# Altium project PCB_Project.PrjPcb
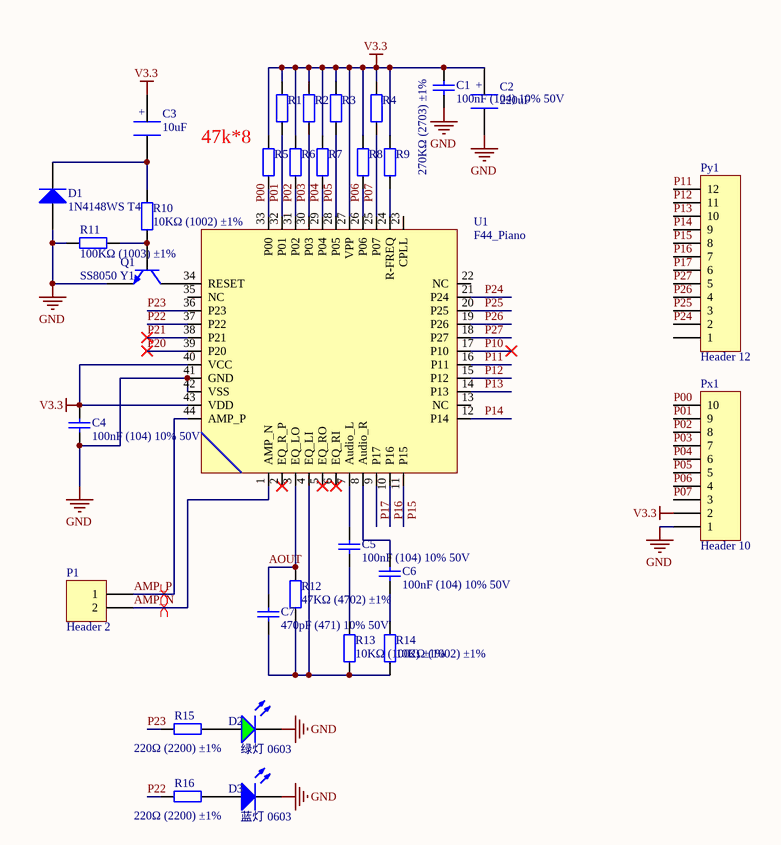
[diagram p0: F44.SchDoc]
4 sheets, 94 parts. Net scope: global (net labels, ports and power ports of the same name join across sheets).
Board file: f44.PcbDoc
Sheets:
  F44.SchDoc
  voice.SchDoc
  fft.SchDoc
  power.SchDoc

## Sheet F44.SchDoc
size A4

### Parts
C1  100nF (104) 10% 50V  [0603_C]
C2  220uF  [8X12_CAP]
C3  10uF  [HDR1X2]
C4  100nF (104) 10% 50V  [0603_C]
C5  100nF (104) 10% 50V  [0603_C]
C6  100nF (104) 10% 50V  [0603_C]
C7  470pF (471) 10% 50V  [0603_C]
D1  1N4148WS T4  [SOD-323]
D2  绿灯 0603  [0603_LED_S1]
D3  蓝灯 0603  [0603_LED_S1]
P1  Header 2  [XH2.54-WS-2P]
Px1  Header 10  [FPC1.0-2H-WS-10P]
Py1  Header 12  [FPC1.0-2H-WS-12P]
Q1  SS8050 Y1  [SOT-23(SOT-23-3)]
R1  47KΩ (4702) ±1%  [0603_R]  (value not drawn)
R2  47KΩ (4702) ±1%  [0603_R]  (value not drawn)
R3  47KΩ (4702) ±1%  [0603_R]  (value not drawn)
R4  47KΩ (4702) ±1%  [0603_R]  (value not drawn)
R5  47KΩ (4702) ±1%  [0603_R]  (value not drawn)
R6  47KΩ (4702) ±1%  [0603_R]  (value not drawn)
R7  47KΩ (4702) ±1%  [0603_R]  (value not drawn)
R8  47KΩ (4702) ±1%  [0603_R]  (value not drawn)
R9  270KΩ (2703) ±1%  [0603_R]
R10  10KΩ (1002) ±1%  [0603_R]
R11  100KΩ (1003) ±1%  [0603_R]
R12  47KΩ (4702) ±1%  [0603_R]
R13  10KΩ (1002) ±1%  [0603_R]
R14  10KΩ (1002) ±1%  [0603_R]
R15  220Ω (2200) ±1%  [0603_R]
R16  220Ω (2200) ±1%  [0603_R]
U1  F44_Piano  [LQFP-44_10x10x08P]

### Nets
GND: C1.1 C2.2 C4.2 D1.1(A) D2.K D3.K Px1.1 Q1.2(E) R11.1 U1.41(GND) U1.42(VSS)
V3.3: C1.2 C2.1 C3.1 C4.1 Px1.2 R1.2 R2.2 R3.2 R4.2 R5.2 R6.2 R7.2 R8.2 R9.2 U1.27(VPP) U1.40(VCC) U1.43(VDD)
AMP_N: P1.2 U1.1(AMP_N)
AMP_P: P1.1 U1.44(AMP_P)
AOUT: C7.2 R12.2 U1.3(EQ_LO)
P00: Px1.10 R5.1 U1.33(P00)
P01: Px1.9 R1.1 U1.32(P01)
P02: Px1.8 R6.1 U1.31(P02)
P03: Px1.7 R2.1 U1.30(P03)
P04: Px1.6 R7.1 U1.29(P04)
P05: Px1.5 R3.1 U1.28(P05)
P06: Px1.4 R8.1 U1.26(P06)
P07: Px1.3 R4.1 U1.25(P07)
P10: U1.17(P10)
P11: Py1.12 U1.16(P11)
P12: Py1.11 U1.15(P12)
P13: Py1.10 U1.14(P13)
P14: Py1.9 U1.12(P14)
P15: Py1.8 U1.11(P15)
P16: Py1.7 U1.10(P16)
P17: Py1.6 U1.9(P17)
P20: U1.39(P20)
P21: U1.38(P21)
P22: R16.1 U1.37(P22)
P23: R15.1 U1.36(P23)
P24: Py1.2 U1.21(P24)
P25: Py1.3 U1.20(P25)
P26: Py1.4 U1.19(P26)
P27: Py1.5 U1.18(P27)
NetC3_2: C3.2 D1.2(K) R10.2
NetC5_1: C5.1 R13.2
NetC5_2: C5.2 U1.7(Audio_L)
NetC6_1: C6.1 R14.2
NetC6_2: C6.2 U1.8(Audio_R)
NetC7_1: C7.1 R12.1 R13.1 R14.1 U1.4(EQ_LI)
NetD2_A: D2.A R15.2
NetD3_A: D3.A R16.2
NetQ1_1: Q1.1(B) R10.1 R11.2
NetQ1_3: Q1.3(C) U1.34(RESET)
NetR9_1: R9.1 U1.24(R-FREQ)

Not connected (* = marked no-connect by the designer): Py1 1; U1 2(EQ_R_P)* 5(EQ_RO)* 6(EQ_RI)* 13(NC) 22(NC) 23(CPLL) 35(NC)

### Layout directives
differential pair: AMP_N, AMP_P

### Notes on the sheet
- (near R5) 47k*8
- (in symbol CAP) +

### Library data of the parts
C1 C4-C6 = 0603 100nF (104) 10% 50V: 贴片电容; ComponentLink1Description: 供应商链接; ComponentLink1URL: http://www.szlcsc.com/product/details_15331.html; Package: 0603; Supplier: LC; SuppliersPartNumber: C14663
C2 C3 = CAP
C7 = 0603 470pF (471) 10% 50V: 贴片电容; ComponentLink1Description: 供应商链接; ComponentLink1URL: http://www.szlcsc.com/product/details_1972.html; Package: 0603; Supplier: LC; SuppliersPartNumber: C1620
D1 = SOD-323 1N4148WS T4: 二极管; ComponentLink1Description: 供应商链接; ComponentLink1URL: http://www.szlcsc.com/product/details_2485.html; Package: SOD-323; Supplier: LC; SuppliersPartNumber: C2128
D2 = 0603 绿灯: 发光二极管; ComponentLink1Description: 供应商链接; ComponentLink1URL: http://www.szlcsc.com/product/details_73152.html; Package: 0603; Supplier: LC; SuppliersPartNumber: C72043
D3 = 0603 蓝灯: 发光二极管; ComponentLink1Description: 供应商链接; ComponentLink1URL: http://www.szlcsc.com/product/details_73150.html; Package: 0603; Supplier: LC; SuppliersPartNumber: C72041
P1 = Header 2: Header, 2-Pin; LatestRevisionDate: 17-Jul-2002; LatestRevisionNote: Re-released for DXP Platform.; Publisher: Altium Limited
Px1 = Header 10: Header, 10-Pin; LatestRevisionDate: 17-Jul-2002; LatestRevisionNote: Re-released for DXP Platform.; Publisher: Altium Limited
Py1 = Header 12: Header, 12-Pin; LatestRevisionDate: 17-Jul-2002; LatestRevisionNote: Re-released for DXP Platform.; Publisher: Altium Limited
Q1 = SOT-23 SS8050 Y1: 三极管; ComponentLink1Description: 供应商链接; ComponentLink1URL: http://www.szlcsc.com/product/details_2507.html; Package: SOT-23; Supplier: LC; SuppliersPartNumber: C2150
R1-R8 R12 = 0603 47KΩ (4702) 1%: 贴片电阻; ComponentLink1Description: 供应商链接; ComponentLink1URL: http://www.szlcsc.com/product/details_26562.html; Package: 0603; Supplier: LC; SuppliersPartNumber: C25819
R9 = 0603 270KΩ (2703) 1%: 贴片电阻; ComponentLink1Description: 供应商链接; ComponentLink1URL: http://www.szlcsc.com/product/details_23692.html; Package: 0603; Supplier: LC; SuppliersPartNumber: C22965
R10 R13 R14 = 0603 10KΩ (1002) 1%: 贴片电阻; ComponentLink1Description: 供应商链接; ComponentLink1URL: http://www.szlcsc.com/product/details_26547.html; Package: 0603; Supplier: LC; SuppliersPartNumber: C25804
R11 = 0603 100KΩ (1003) 1%: 贴片电阻; ComponentLink1Description: 供应商链接; ComponentLink1URL: http://www.szlcsc.com/product/details_26546.html; Package: 0603; Supplier: LC; SuppliersPartNumber: C25803
R15 R16 = 0603 220Ω (2200) 1%: 贴片电阻; ComponentLink1Description: 供应商链接; ComponentLink1URL: http://www.szlcsc.com/product/details_23689.html; Package: 0603; Supplier: LC; SuppliersPartNumber: C22962

## Sheet voice.SchDoc
size A4
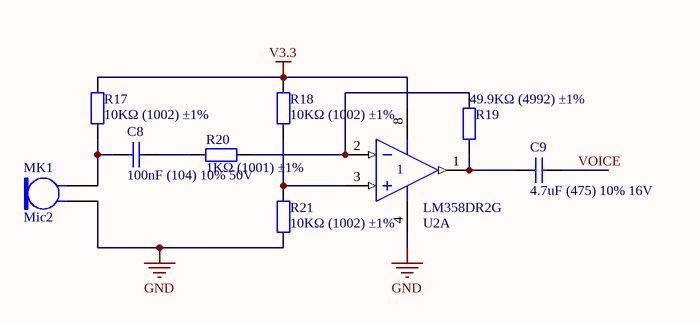
[diagram p1: voice.SchDoc]

### Parts
C8  100nF (104) 10% 50V  [0603_C]
C9  4.7uF (475) 10% 16V  [0603_C]
MK1  Mic2  [PIN2]
R17  10KΩ (1002) ±1%  [0603_R]
R18  10KΩ (1002) ±1%  [0603_R]
R19  49.9KΩ (4992) ±1%  [0603_R]
R20  1KΩ (1001) ±1%  [0603_R]
R21  10KΩ (1002) ±1%  [0603_R]
U2  LM358DR2G  [SOIC-8_150mil]  (part A of 2)

### Nets
GND: MK1.1 R21.1 U2.4(V-)
V3.3: R17.2 R18.2 U2.8(V+)
VOICE: C9.2
NetC8_1: C8.1 MK1.2 R17.1
NetC8_2: C8.2 R20.1
NetC9_1: C9.1 R19.1 U2.1(OUT)
NetR18_1: R18.1 R21.2 U2.3(IN+)
NetR19_2: R19.2 R20.2 U2.2(IN-)

### Library data of the parts
C8 = 0603 100nF (104) 10% 50V: 贴片电容; ComponentLink1Description: 供应商链接; ComponentLink1URL: http://www.szlcsc.com/product/details_15331.html; Package: 0603; Supplier: LC; SuppliersPartNumber: C14663
C9 = 0603 4.7uF (475) 10% 16V: 贴片电容; ComponentLink1Description: 供应商链接; ComponentLink1URL: http://www.szlcsc.com/product/details_20375.html; Package: 0603; Supplier: LC; SuppliersPartNumber: C19666
MK1 = Mic2: Microphone; Published: 24-Mar-1999; LatestRevisionDate: 17-Jul-2002; LatestRevisionNote: Re-released for DXP Platform.; PackageReference: PIN2; Publisher: Altium Limited
R17 R18 R21 = 0603 10KΩ (1002) 1%: 贴片电阻; ComponentLink1Description: 供应商链接; ComponentLink1URL: http://www.szlcsc.com/product/details_26547.html; Package: 0603; Supplier: LC; SuppliersPartNumber: C25804
R19 = 0603 49.9KΩ (4992) 1%: 贴片电阻; ComponentLink1Description: 供应商链接; ComponentLink1URL: http://www.szlcsc.com/product/details_23911.html; Package: 0603; Supplier: LC; SuppliersPartNumber: C23184
R20 = 0603 1KΩ (1001) 1%: 贴片电阻; ComponentLink1Description: 供应商链接; ComponentLink1URL: http://www.szlcsc.com/product/details_21904.html; Package: 0603; Supplier: LC; SuppliersPartNumber: C21190
U2 = LM358DR2G_[C7950]: 通用运放; ComponentLink1Description: 供应商链接; ComponentLink1URL: http://www.szlcsc.com/product/details_8427.html; Package: SOIC-8; Supplier: LC; SuppliersPartNumber: C7950

## Sheet fft.SchDoc
size A4
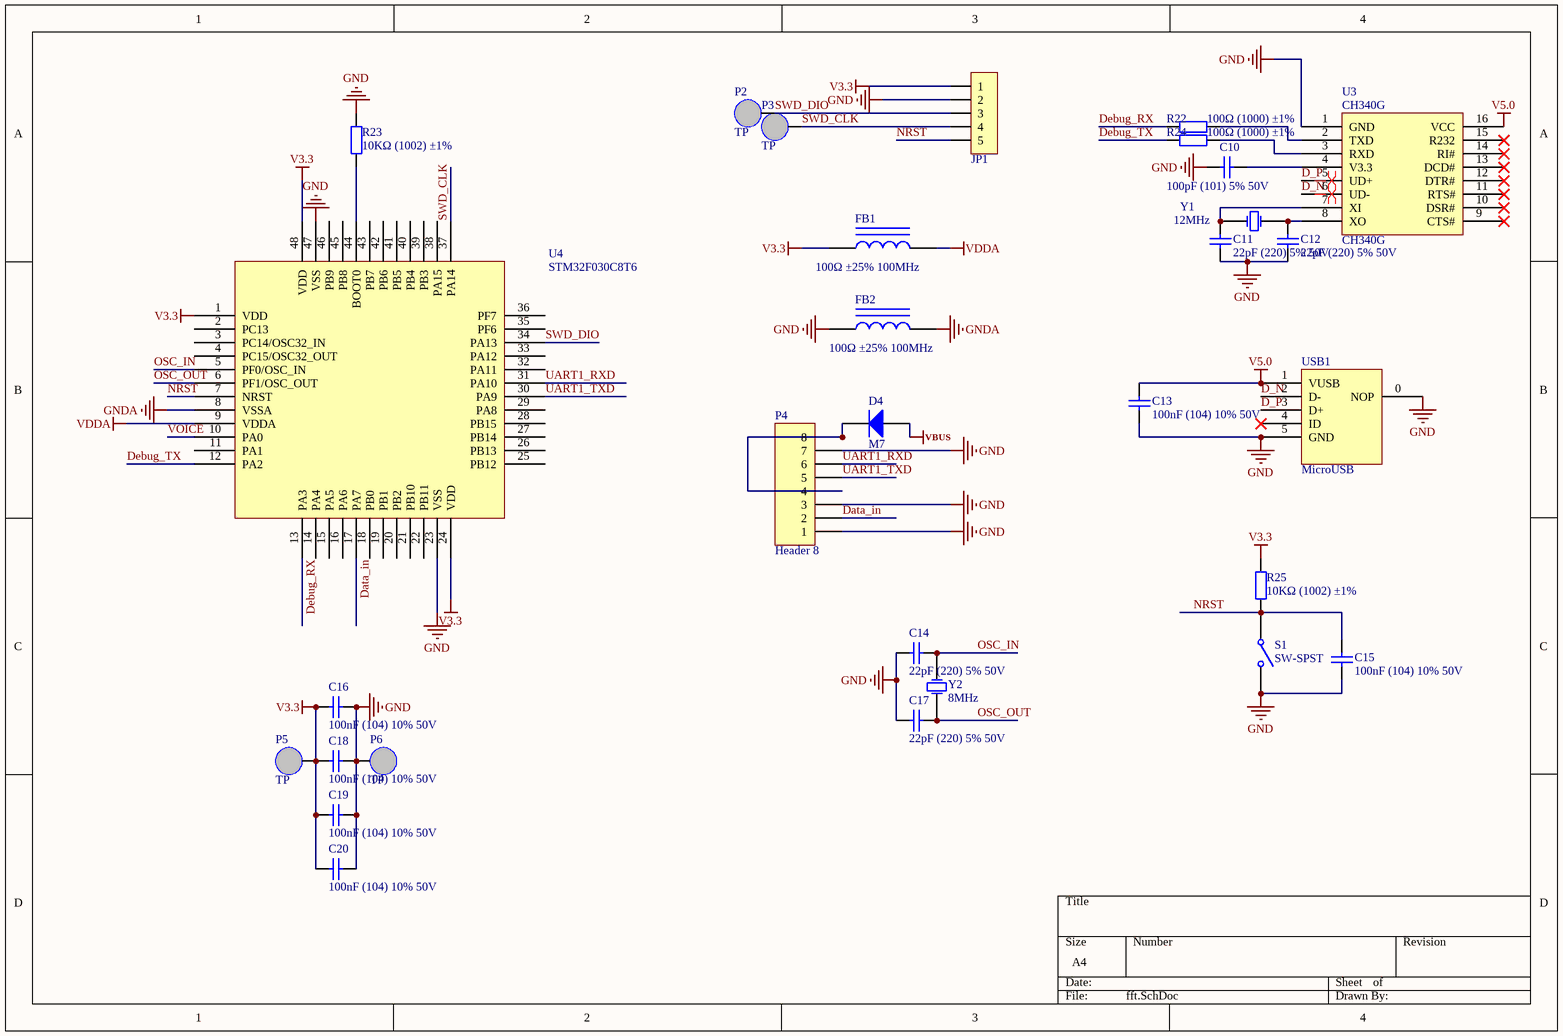
[diagram p2: fft.SchDoc]

### Parts
C10  100pF (101) 5% 50V  [0805_C]
C11  22pF (220) 5% 50V  [0805_C]
C12  22pF (220) 5% 50V  [0805_C]
C13  100nF (104) 10% 50V  [0603_C]
C14  22pF (220) 5% 50V  [0805_C]
C15  100nF (104) 10% 50V  [0603_C]
C16  100nF (104) 10% 50V  [0603_C]
C17  22pF (220) 5% 50V  [0805_C]
C18  100nF (104) 10% 50V  [0603_C]
C19  100nF (104) 10% 50V  [0603_C]
C20  100nF (104) 10% 50V  [0603_C]
D4  M7  [SMA(DO-214AC)_S1]
FB1  100Ω ±25% 100MHz  [0805_L]
FB2  100Ω ±25% 100MHz  [0805_L]
JP1  HDR-1X5  [XH2.54-LI-5P]  (value not drawn)
P2  TP  [TP]
P3  TP  [TP]
P4  Header 8  [FPC1.0-2H-WS-8P]
P5  TP  [TP]
P6  TP  [TP]
R22  100Ω (1000) ±1%  [0603_R]
R23  10KΩ (1002) ±1%  [0603_R]
R24  100Ω (1000) ±1%  [0603_R]
R25  10KΩ (1002) ±1%  [0805_R]
S1  SW-SPST  [TSW SMD-3*6*2.5]
U3  CH340G  [SOIC-16_150mil]
U4  STM32F030C8T6  [LQFP-48_7x7x05P]
USB1  MicroUSB  [MicroUSB]
Y1  12MHz  [Y]
Y2  8MHz  [SMD-5032_2P]

### Nets
GND: C10.1 C11.2 C12.2 C13.1 C14.2 C15.1 C16.2 C17.2 C18.2 C19.2 C20.2 FB2.1 JP1.2 P4.1 P4.3 P4.7 P6.1 R23.2 S1.2(NO) U3.1(GND) U4.23(VSS) U4.47(VSS) USB1.0(NOP) USB1.5(GND)
GNDA: FB2.2 U4.8(VSSA)
V3.3: C16.1 C18.1 C19.1 C20.1 FB1.1 JP1.1 P5.1 R25.2 U4.1(VDD) U4.24(VDD) U4.48(VDD)
V5.0: C13.2 U3.16(VCC) USB1.1(VUSB)
VBUS: D4.1(A)
VDDA: FB1.2 U4.9(VDDA)
D_N: U3.6(UD-) USB1.2(D-)
D_P: U3.5(UD+) USB1.3(D+)
Data_in: P4.2 U4.17(PA7)
Debug_RX: R22.1 U4.13(PA3)
Debug_TX: R24.1 U4.12(PA2)
NRST: C15.2 JP1.5 R25.1 S1.1(COMMON) U4.7(NRST)
OSC_IN: C14.1 U4.5(PF0/OSC_IN) Y2.1(OSC1)
OSC_OUT: C17.1 U4.6(PF1/OSC_OUT) Y2.2(OSC2)
SWD_CLK: JP1.4 P3.1 U4.37(PA14)
SWD_DIO: JP1.3 P2.1 U4.34(PA13)
UART1_RXD: P4.6 U4.31(PA10)
UART1_TXD: P4.5 U4.30(PA9)
VOICE: U4.10(PA0)
NetC10_2: C10.2 U3.4(V3.3)
NetC11_1: C11.1 U3.7(XI) Y1.1(OSC1)
NetC12_1: C12.1 U3.8(XO) Y1.2(OSC2)
NetD4_2: D4.2(K) P4.4 P4.8
NetR22_2: R22.2 U3.2(TXD)
NetR23_1: R23.1 U4.44(BOOT0)
NetR24_2: R24.2 U3.3(RXD)

Not connected (* = marked no-connect by the designer): U3 9(CTS#)* 10(DSR#)* 11(RTS#)* 12(DTR#)* 13(DCD#)* 14(RI#)* 15(R232)*; U4 2(PC13) 3(PC14/OSC32_IN) 4(PC15/OSC32_OUT) 11(PA1) 14(PA4) 15(PA5) 16(PA6) 18(PB0) 19(PB1) 20(PB2) 21(PB10) 22(PB11) 25(PB12) 26(PB13) 27(PB14) 28(PB15) 29(PA8) 32(PA11) 33(PA12) 35(PF6) 36(PF7) 38(PA15) 39(PB3) 40(PB4) 41(PB5) 42(PB6) 43(PB7) 45(PB8) 46(PB9); USB1 4(ID)*

### Layout directives
differential pair: (no net found under the mark)

### Library data of the parts
C10 = 0805 100pF (101) 5% 50V: 贴片电容; ComponentLink1Description: 供应商链接; ComponentLink1URL: http://www.szlcsc.com/product/details_2142.html; Package: 0805; Supplier: LC; SuppliersPartNumber: C1790
C11 C12 C14 C17 = 0805 22pF (220) 5% 50V: 贴片电容; ComponentLink1Description: 供应商链接; ComponentLink1URL: http://www.szlcsc.com/product/details_2156.html; Package: 0805; Supplier: LC; SuppliersPartNumber: C1804
C13 C15 C16 C18-C20 = 0603 100nF (104) 10% 50V: 贴片电容; ComponentLink1Description: 供应商链接; ComponentLink1URL: http://www.szlcsc.com/product/details_15331.html; Package: 0603; Supplier: LC; SuppliersPartNumber: C14663
D4 = SMA(DO-214AC) M7: 二极管; 备注: 1N4007 4007 编号C2464 已经停售, 使用新物料编号C95872; ComponentLink1Description: 供应商链接; ComponentLink1URL: http://www.szlcsc.com/product/details_2841.html; Package: SMA(DO-214AC); Supplier: LC; SuppliersPartNumber: C95872
FB1 FB2 = 0805 100Ω 25% 100MHz: 贴片磁珠; ComponentLink1Description: 供应商链接; ComponentLink1URL: http://www.szlcsc.com/product/details_1367.html; Package: 0805; Supplier: LC; SuppliersPartNumber: C1015
JP1 = Header 5: 5P接插件; 版权归属: 源创客; BOM名称: 5P接插件; 学习资源: www.ooocke.com
P4 = Header 8: Header, 8-Pin; LatestRevisionDate: 17-Jul-2002; LatestRevisionNote: Re-released for DXP Platform.; Publisher: Altium Limited
R22 R24 = 0603 100Ω (1000) 1%: 贴片电阻; ComponentLink1Description: 供应商链接; ComponentLink1URL: http://www.szlcsc.com/product/details_23502.html; Package: 0603; Supplier: LC; SuppliersPartNumber: C22775
R23 = 0603 10KΩ (1002) 1%: 贴片电阻; ComponentLink1Description: 供应商链接; ComponentLink1URL: http://www.szlcsc.com/product/details_26547.html; Package: 0603; Supplier: LC; SuppliersPartNumber: C25804
R25 = 0805 10KΩ (1002) 1%: 贴片电阻; ComponentLink1Description: 供应商链接; ComponentLink1URL: http://www.szlcsc.com/product/details_18102.html; Package: 0805; Supplier: LC; SuppliersPartNumber: C17414
S1 = SW-SPST: Single-Pole, Single-Throw Switch; Published: 24-Mar-1999; LatestRevisionDate: 17-Jul-2002; LatestRevisionNote: Re-released for DXP Platform.; PackageReference: SPST-2; Publisher: Altium Limited; PackageDescription: Switch; 2 Leads
U3 = CH340G_[C14267]: USB; ComponentLink1Description: 供应商链接; ComponentLink1URL: http://www.szlcsc.com/product/details_14927.html; Package: SOIC-16_150mil; Supplier: LC; SuppliersPartNumber: C14267
U4 = STM32F030C8T6: ARM; ComponentLink1Description: 供应商链接; ComponentLink1URL: http://www.szlcsc.com/product/details_24662.html; Package: LQFP-48_7x7x05P; Supplier: LC; SuppliersPartNumber: C23922
Y1 Y2 = SMD-5032_2P 8MHz 20ppm 20pF: 贴片晶振; ComponentLink1Description: 供应商链接; ComponentLink1URL: http://www.szlcsc.com/product/details_117214.html; Package: SMD-5032_2P; Supplier: LC; SuppliersPartNumber: C115962

## Sheet power.SchDoc
size A4
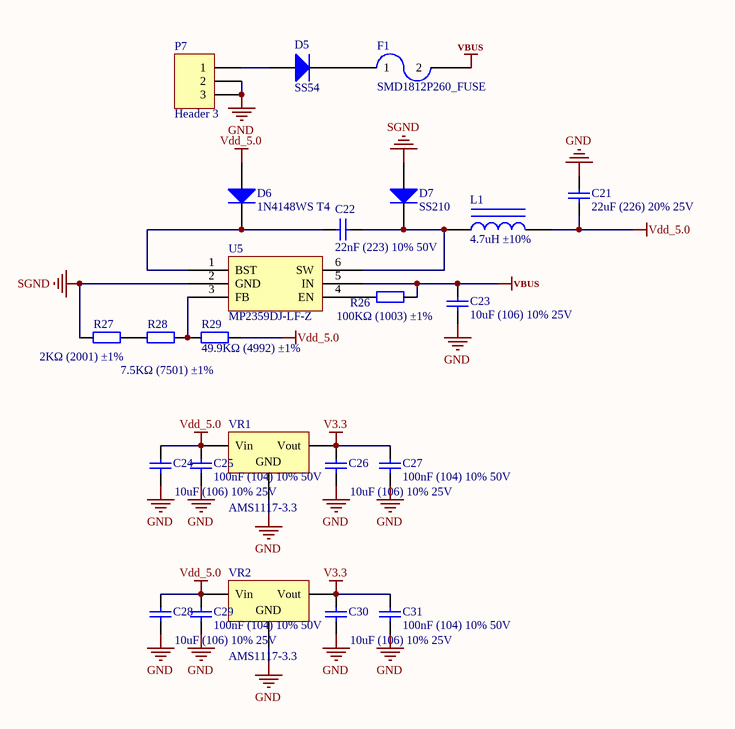
[diagram p3: power.SchDoc]

### Parts
C21  22uF (226) 20% 25V  [0805_C]
C22  22nF (223) 10% 50V  [0603_C]
C23  10uF (106) 10% 25V  [0805_C]
C24  10uF (106) 10% 25V  [0805_C]
C25  100nF (104) 10% 50V  [0603_C]
C26  10uF (106) 10% 25V  [0805_C]
C27  100nF (104) 10% 50V  [0603_C]
C28  10uF (106) 10% 25V  [0805_C]
C29  100nF (104) 10% 50V  [0603_C]
C30  10uF (106) 10% 25V  [0805_C]
C31  100nF (104) 10% 50V  [0603_C]
D5  SS54  [SMA(DO-214AC)_S1]
D6  1N4148WS T4  [SOD-323]
D7  SS210  [SMA(DO-214AC)_S1]
F1  SMD1812P260_FUSE  [SMD1812P260]
L1  4.7uH ±10%  [L_4030]
P7  Header 3  [DC-005]
R26  100KΩ (1003) ±1%  [0603_R]
R27  2KΩ (2001) ±1%  [0603_R]
R28  7.5KΩ (7501) ±1%  [0603_R]
R29  49.9KΩ (4992) ±1%  [0603_R]
U5  MP2359DJ-LF-Z  [SOT-23-6]
VR1  AMS1117-3.3  [SOT-223]
VR2  AMS1117-3.3  [SOT-223]

### Nets
GND: C21.2 C23.1 C24.1 C25.1 C26.1 C27.1 C28.1 C29.1 C30.1 C31.1 P7.2 P7.3 VR1.1(GND) VR2.1(GND)
SGND: D7.1(A) R27.2 U5.2(GND)
V3.3: C26.2 C27.2 C30.2 C31.2 VR1.2(Vout) VR2.2(Vout)
VBUS: C23.2 F1.2 R26.2 U5.5(IN)
Vdd_5.0: C21.1 C24.2 C25.2 C28.2 C29.2 D6.1(A) L1.2 R29.2 VR1.3(Vin) VR2.3(Vin)
NetC22_1: C22.1 D6.2(K) U5.1(BST)
NetC22_2: C22.2 D7.2(K) L1.1 U5.6(SW)
NetD5_1: D5.1(A) P7.1
NetD5_2: D5.2(K) F1.1
NetR26_1: R26.1 U5.4(EN)
NetR27_1: R27.1 R28.2
NetR28_1: R28.1 R29.1 U5.3(FB)

### Library data of the parts
C21 = 0805 22uF (226) 20% 25V: 贴片电容; ComponentLink1Description: 供应商链接; ComponentLink1URL: http://www.szlcsc.com/product/details_46786.html; Package: 0805; Supplier: LC; SuppliersPartNumber: C45783
C22 = 0603 22nF (223) 10% 50V: 贴片电容; ComponentLink1Description: 供应商链接; ComponentLink1URL: http://www.szlcsc.com/product/details_21834.html; Package: 0603; Supplier: LC; SuppliersPartNumber: C21122
C23 C24 C26 C28 C30 = 0805 10uF (106) 10% 25V: 贴片电容; ComponentLink1Description: 供应商链接; ComponentLink1URL: http://www.szlcsc.com/product/details_16532.html; Package: 0805; Supplier: LC; SuppliersPartNumber: C15850
C25 C27 C29 C31 = 0603 100nF (104) 10% 50V: 贴片电容; ComponentLink1Description: 供应商链接; ComponentLink1URL: http://www.szlcsc.com/product/details_15331.html; Package: 0603; Supplier: LC; SuppliersPartNumber: C14663
D5 = SMA(DO-214AC) SS54: 二极管; ComponentLink1Description: 供应商链接; ComponentLink1URL: http://www.szlcsc.com/product/details_23178.html; Package: SMA(DO-214AC); Supplier: LC; SuppliersPartNumber: C22452
D6 = SOD-323 1N4148WS T4: 二极管; ComponentLink1Description: 供应商链接; ComponentLink1URL: http://www.szlcsc.com/product/details_2485.html; Package: SOD-323; Supplier: LC; SuppliersPartNumber: C2128
D7 = SMA(DO-214AC) SS210: 二极管; ComponentLink1Description: 供应商链接; ComponentLink1URL: http://www.szlcsc.com/product/details_15669.html; Package: SMA(DO-214AC); Supplier: LC; SuppliersPartNumber: C14996
L1 = 0603 4.7uH 10%: 贴片电感; ComponentLink1Description: 供应商链接; ComponentLink1URL: http://www.szlcsc.com/product/details_1386.html; Package: 0603; Supplier: LC; SuppliersPartNumber: C1034
P7 = Header 3: Header, 3-Pin; LatestRevisionDate: 17-Jul-2002; LatestRevisionNote: Re-released for DXP Platform.; Publisher: Altium Limited
R26 = 0603 100KΩ (1003) 1%: 贴片电阻; ComponentLink1Description: 供应商链接; ComponentLink1URL: http://www.szlcsc.com/product/details_26546.html; Package: 0603; Supplier: LC; SuppliersPartNumber: C25803
R27 = 0603 2KΩ (2001) 1%: 贴片电阻; ComponentLink1Description: 供应商链接; ComponentLink1URL: http://www.szlcsc.com/product/details_23702.html; Package: 0603; Supplier: LC; SuppliersPartNumber: C22975
R28 = 0603 7.5KΩ (7501) 1%: 贴片电阻; ComponentLink1Description: 供应商链接; ComponentLink1URL: http://www.szlcsc.com/product/details_23961.html; Package: 0603; Supplier: LC; SuppliersPartNumber: C23234
R29 = 0603 49.9KΩ (4992) 1%: 贴片电阻; ComponentLink1Description: 供应商链接; ComponentLink1URL: http://www.szlcsc.com/product/details_23911.html; Package: 0603; Supplier: LC; SuppliersPartNumber: C23184
U5 = MP2359DJ-LF-Z_[C14259]: DC-DC芯片; ComponentLink1Description: 供应商链接; ComponentLink1URL: http://www.szlcsc.com/product/details_14917.html; Package: SOT-23-6; Supplier: LC; SuppliersPartNumber: C14259
VR1 VR2 = SOT-223 AMS1117-3.3: 低压差线性稳压(LDO); ComponentLink1Description: 供应商链接; ComponentLink1URL: http://www.szlcsc.com/product/details_6652.html; Package: SOT-223; Supplier: LC; SuppliersPartNumber: C6186

## Nets that join several sheets
GND: F44 (11 pins), voice (MK1.1 R21.1 U2.4), fft (24 pins), power (14 pins)
V3.3: F44 (17 pins), voice (R17.2 R18.2 U2.8), fft (11 pins), power (6 pins)
VBUS: fft (D4.1), power (C23.2 F1.2 R26.2 U5.5)
VOICE: voice (C9.2), fft (U4.10)